# Altium schematic sheet MAIN.SchDoc
size A4
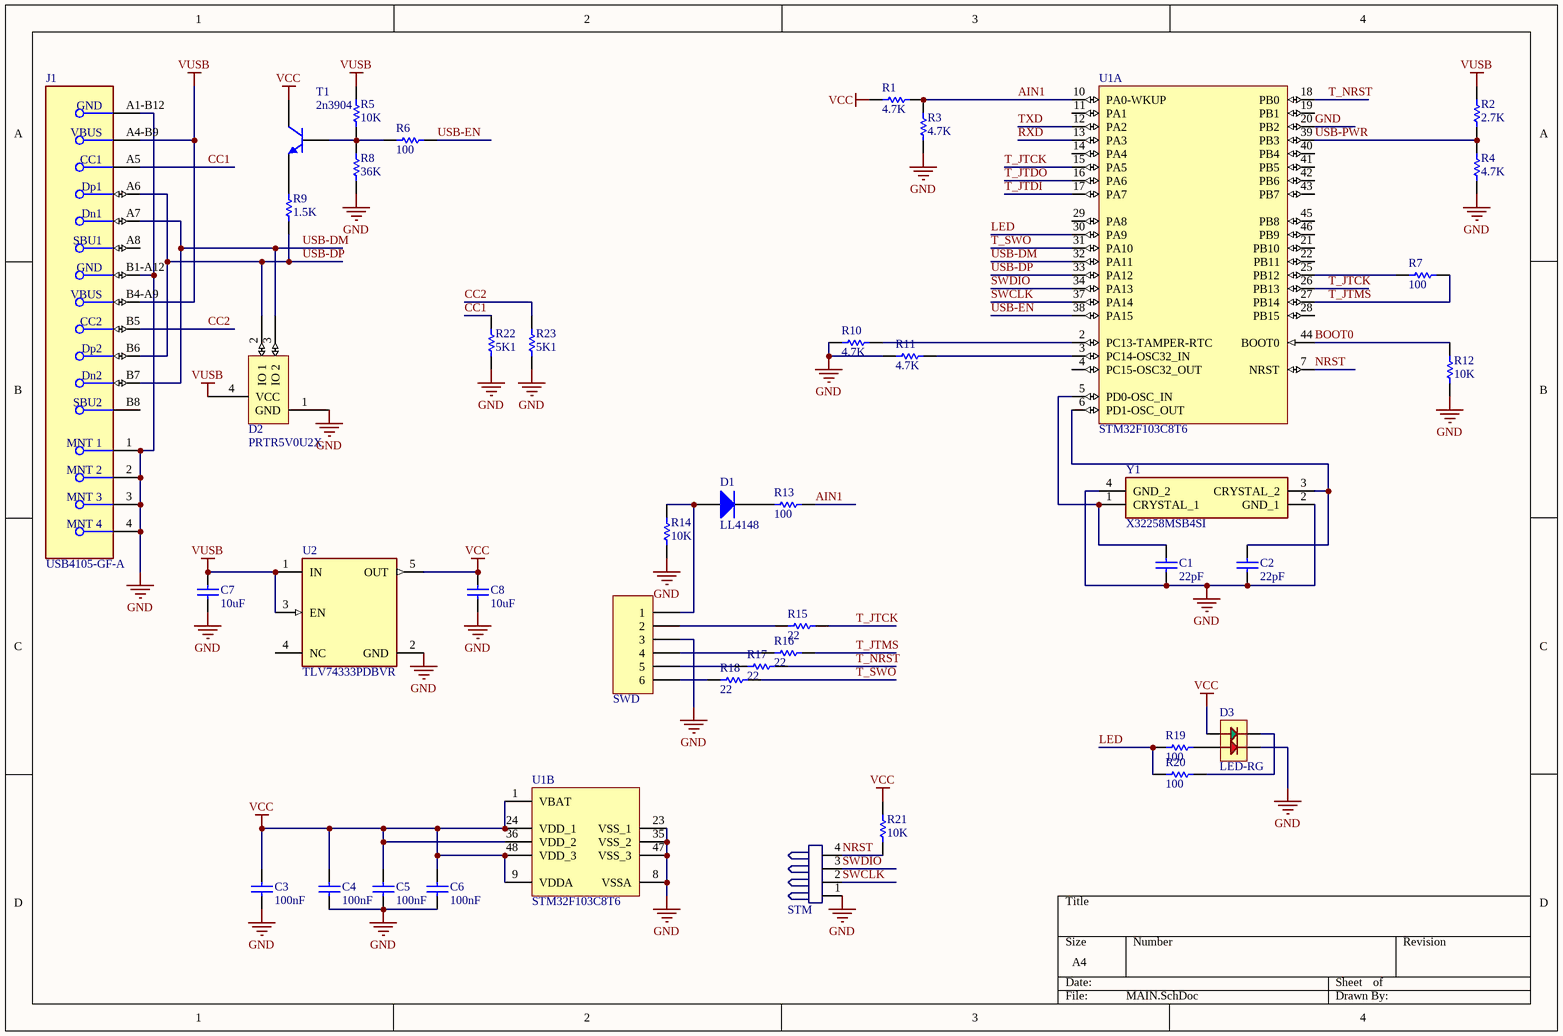
[diagram p0: MAIN.SchDoc]

## Parts
C1  22pF  [C603]
C2  22pF  [C603]
C3  100nF  [C603]
C4  100nF  [C603]
C5  100nF  [C603]
C6  100nF  [C603]
C7  10uF  [C805]
C8  10uF  [C805]
D1  LL4148  [SOD-80]
D2  PRTR5V0U2X  [SOT-143B]
D3  LED-RG  [LED-1210]
J1  USB4105-GF-A  [FP-USB4105-GF-A-MFG]
R1  4.7K  [R0603]
R2  2.7K  [R0603]
R3  4.7K  [R0603]
R4  4.7K  [R0603]
R5  10K  [R0603]
R6  100  [R0603]
R7  100  [R0603]
R8  36K  [R0603]
R9  1.5K  [R0603]
R10  4.7K  [R0603]
R11  4.7K  [R0603]
R12  10K  [R0603]
R13  100  [R0603]
R14  10K  [R0603]
R15  22  [R0603]
R16  22  [R0603]
R17  22  [R0603]
R18  22  [R0603]
R19  100  [R0603]
R20  100  [R0603]
R21  10K  [R0603]
R22  5K1  [R0603]
R23  5K1  [R0603]
STM  PHDR 4  [PH-4]  (value not drawn)
SWD  CONN-6  [XH-6]  (value not drawn)
T1  2n3904  [SOT-23-3]
U1  STM32F103C8T6  [LQFP-48]  (parts A,B of 2)
U2  TLV74333PDBVR  [FP-DBV0005A-MFG]
Y1  X32258MSB4SI  [SMD3225_4P12288MHZ12PF10PPM4085]

## Nets
GND: C1.1 C2.1 C3.1 C4.1 C5.1 C6.1 C7.1 C8.1 D2.1(GND) D3.3(RED-C) J1.1(MNT_1) J1.2(MNT_2) J1.3(MNT_3) J1.4(MNT_4) J1.A1-B12(GND) J1.B1-A12(GND) R3.1 R4.1 R8.2 R10.2 R11.2 R12.1 R14.2 R22.2 R23.2 STM.1 SWD.3 U1.8(VSSA) U1.20(PB2) U1.23(VSS_1) U1.35(VSS_2) U1.47(VSS_3) U2.2(GND) Y1.2(GND_1) Y1.4(GND_2)
VCC: C3.2 C4.2 C5.2 C6.2 C8.2 D3.1(GRN-A) R1.2 R21.2 T1.1(C) U1.1(VBAT) U1.9(VDDA) U1.24(VDD_1) U1.36(VDD_2) U1.48(VDD_3) U2.5(OUT)
VUSB: C7.2 D2.4(VCC) J1.A4-B9(VBUS) J1.B4-A9(VBUS) R2.1 R5.1 U2.1(IN) U2.3(EN)
AIN1: R1.1 R3.2 R13.2 U1.10(PA0-WKUP)
BOOT0: R12.2 U1.44(BOOT0)
CC1: J1.A5(CC1) R22.1
CC2: J1.B5(CC2) R23.1
LED: R19.2 R20.2 U1.30(PA9)
NRST: R21.1 STM.4 U1.7(NRST)
RXD: U1.13(PA3)
SWCLK: STM.2 U1.37(PA14)
SWDIO: STM.3 U1.34(PA13)
T_JTCK: R15.1 U1.15(PA5) U1.26(PB13)
T_JTDI: U1.17(PA7)
T_JTDO: U1.16(PA6)
T_JTMS: R7.1 R16.1 U1.27(PB14)
T_NRST: R17.1 U1.18(PB0)
T_SWO: R18.1 U1.31(PA10)
TXD: U1.12(PA2)
USB-DM: D2.3(IO_2) J1.A7(Dn1) J1.B7(Dn2) U1.32(PA11)
USB-DP: D2.2(IO_1) J1.A6(Dp1) J1.B6(Dp2) R9.2 U1.33(PA12)
USB-EN: R6.2 U1.38(PA15)
USB-PWR: R2.2 R4.2 U1.39(PB3)
NetC1_2: C1.2 U1.5(PD0-OSC_IN) Y1.1(CRYSTAL_1)
NetC2_2: C2.2 U1.6(PD1-OSC_OUT) Y1.3(CRYSTAL_2)
NetD1_1: D1.1(A) R14.1 SWD.1
NetD1_2: D1.2(K) R13.1
NetD3_2: D3.2(RED-A) R19.1
NetD3_4: D3.4(GRN-C) R20.1
NetR5_2: R5.2 R6.1 R8.1 T1.3(B)
NetR7_2: R7.2 U1.25(PB12)
NetR9_1: R9.1 T1.2(E)
NetR10_1: R10.1 U1.2(PC13-TAMPER-RTC)
NetR11_1: R11.1 U1.3(PC14-OSC32_IN)
NetR15_2: R15.2 SWD.2
NetR16_2: R16.2 SWD.4
NetR17_2: R17.2 SWD.5
NetR18_2: R18.2 SWD.6

Not connected (* = marked no-connect by the designer): J1 A8(SBU1) B8(SBU2); U1 4(PC15-OSC32_OUT) 11(PA1) 14(PA4) 19(PB1) 21(PB10) 22(PB11) 28(PB15) 29(PA8) 40(PB4) 41(PB5) 42(PB6) 43(PB7) 45(PB8) 46(PB9); U2 4(NC)

## Library data of the parts
C1-C8 = Cap: Capacitor; Designer: Parsa Malekpour
  C1 C2: Value: 22pF
  C3-C6: Value: 100nF
  C7 C8: Value: 10uF
D2 = PRTR5V0U2X: Ultra low capacitance double rail-to-rail ESD protection diode; reverse standoff voltage: 5.5V
D3 = LED-RG-4
J1 = CMP-245163-000001-1: CONN RCPT USB2.0 TYPEC 5A; Manufacturer: GCT; Voltage Rating: 20V; Is Female: yes; Current Rating: 5/6.25/1.25/0.25A; Number Of Contacts: 16; Conn Orientation: Right Angle; Device Class L1: Connectors; Category: Conn; Lead Free: Yes; RoHS: TRUE; Temperature Range High: +85°C; Digikey Description: CONN RCPT USB2.0 TYPEC 5A; Device Class L3: unset; ComponentLink2Description: Datasheet; Manufacturer Part Number: USB4105-GF-A; Package: 0; Usb Standard: USB 2.0; Device Class L2: USB Connectors; Automotive: No; Temperature Range Low: -40°C; Height: 3.46mm; Temperature: -40°C to +85°C; Contact Material: Gold,Nickel; ComponentLink2URL: https://gct.co/files/drawings/usb4105.pdf; Octopart: https://octopart.com/usb4105-gf-a-gct-106627878
R1-R23 = Resistor: Designer: Parsa Malekpour
  R1 R3 R4 R10 R11: Value: 4.7K
  R2: Value: 2.7K
  R5 R12 R14 R21: Value: 10K
  R6 R7 R13 R19 R20: Value: 100
  R8: Value: 36K
  R9: Value: 1.5K
  R15-R18: Value: 22
  R22 R23: Value: 5K1
STM = PHDR 4: PinHeader
T1 = 2n3904: Mark: 1A
U1 = STM32F103C8T6: ARM Cortex-M3 32-bit MCU, 64 KB Flash, 20 KB Internal RAM, 37 I/Os, 48-pin LQFP, -40 to 85 degC, Tray; A/D Converter: 2x12-bit (10 Channel); FLASH Size (Prog) (kB): 64; I/Os (High Current): 37; Internal RAM Size (kB): 20; Operating Frequency(F) (Processor speed) (MHz): 72; Supply Voltage(Vcc) min (V): 2; DatasheetVersion: Rev. 16; PackageVersion: Rev. 6, 06/2013; PackageReference: LQFP48; PackageDescription: 48-Pin Low Profile Quad Flat Package, 7 x 7 mm Body, 0.5 mm Pitch; Supplier 1: Digi-Key; Supplier Part Number 1: 497-6063-ND; Supplier 2: Farnell; Supplier Part Number 2: 1447637; Supplier 3: Newark; Supplier Part Number 3: 59M2182; Supplier 4: Newark; Supplier Part Number 4: 57P1222; Supplier 5: Mouser; Supplier Part Number 5: 511-STM32F103C8T6; Core: ARM Cortex-M3; Packing: Tray; Mounting Technology: Surface Mount; PartNumber: STM32F103C8T6; ComponentLink1Description: Manufacturer URL; ComponentLink1URL: http://www.st.com/web/en/home.html; ComponentLink2Description: Datasheet; ComponentLink2URL: http://www.st.com/st-web-ui/static/active/en/resource/technical/document/datasheet/CD00161566.pdf; ComponentLink3Description: Package Specification; ComponentLink3URL: http://www.st.com/st-web-ui/static/active/en/resource/technical/document/datasheet/DM00058181.pdf
U2 = CMP-04917-000051-1: IC REG LINEAR 3.3V 300MA SOT23-5; Manufacturer: Texas Instruments; Dropout Voltage: 125mV; Description: Linear Voltage Regulator IC  1 Output  300mA SOT-23-5; Output Type: Fixed; Min Supply Voltage: 1.4V; Max Supply Voltage: 5.5V; Output Voltage: 1-3.3V; Standoff Height: 0mm; Nominal Supply Current: 34uA; Number Of Outputs: 1; Accuracy Percentage: 1%; Max Junction Temp: +125°C; Mouser Description: 300mA Low-Dropout (LDO) Regulator 5-SOT-23 -40 to 125; Device Class L1: Integrated Circuits (ICs); Temperature Range High: +125°C; Octopart: https://octopart.com/tlv74333pdbvr-texas+instruments-84791760; Device Class L3: Voltage Regulators - Linear; Height: 1.45mm; Category: IC; Temperature Range Low: -40°C; Output Current: 300mA; RoHS: TRUE; Automotive: No; Manufacturer Part Number: TLV74333PDBVR; Digikey Description: IC REG LINEAR 3.3V 300MA SOT23-5; Package: DBV0005A; Temperature: -40°C to +125°C; ComponentLink2URL: http://www.ti.com/lit/ds/symlink/tlv743p.pdf; Lead Free: Yes; Device Class L2: Power Management ICs; ComponentLink2Description: Datasheet
Y1 = SMD-3225_4P_12.288MHZ_12PF_10PPM_-40~+85: Crystal or Oscillator; Manufacturer_Name: TAE(Zhejiang Abel Elec); Manufacturer_Part_Number: SMD-3225_4P 12.288MHZ 12PF 10PPM -40~+85¡æ; Datasheet Link: https://datasheet.lcsc.com/szlcsc/1901241506_Zhejiang-Abel-Elec-SMD-3225-4P-12-288MHZ-12PF-10PPM-40-85_C362472.pdf; Height: 0.8mm